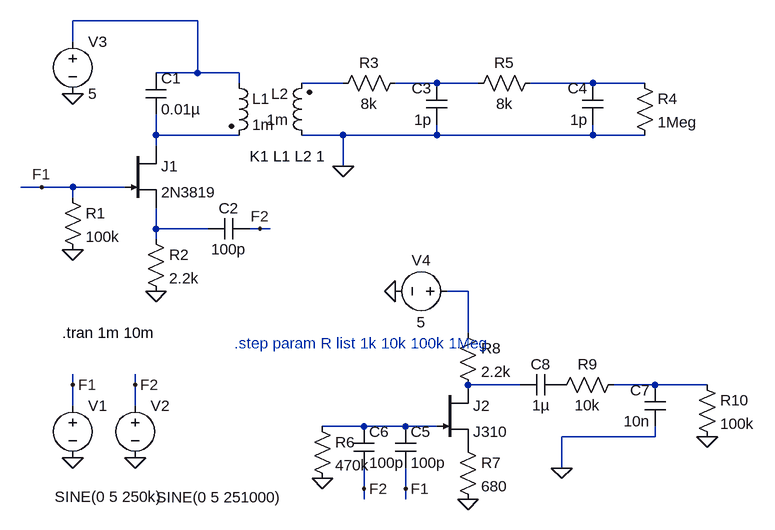
[diagram p0: schematic Draft2.asc]
Draft2.asc, the LTspice schematic file:
Version 4
SHEET 1 1184 680
WIRE 320 -144 128 -144
WIRE 128 -112 128 -144
WIRE 320 -64 320 -144
WIRE 320 -64 256 -64
WIRE 384 -64 320 -64
WIRE 384 -48 384 -64
WIRE 544 -48 480 -48
WIRE 688 -48 624 -48
WIRE 752 -48 688 -48
WIRE 928 -48 832 -48
WIRE 1008 -48 928 -48
WIRE 256 32 256 0
WIRE 384 32 256 32
WIRE 544 32 480 32
WIRE 688 32 688 16
WIRE 688 32 544 32
WIRE 928 32 928 16
WIRE 928 32 688 32
WIRE 1008 32 928 32
WIRE 256 48 256 32
WIRE 544 80 544 32
WIRE 80 112 48 112
WIRE 128 112 80 112
WIRE 208 112 128 112
WIRE 128 128 128 112
WIRE 256 176 256 144
WIRE 336 176 256 176
WIRE 416 176 400 176
WIRE 432 176 416 176
WIRE 256 192 256 176
WIRE 736 272 704 272
WIRE 736 336 736 272
WIRE 128 416 128 400
WIRE 224 416 224 400
WIRE 816 416 736 416
WIRE 1024 416 960 416
WIRE 1104 416 1024 416
WIRE 128 448 128 416
WIRE 224 448 224 416
WIRE 576 480 512 480
WIRE 640 480 576 480
WIRE 688 480 640 480
WIRE 1024 496 1024 480
WIRE 1024 496 880 496
WIRE 880 544 880 496
WIRE 576 576 576 544
WIRE 640 576 640 544
WIRE 576 592 576 576
WIRE 640 592 640 576
FLAG 128 528 0
FLAG 224 528 0
FLAG 128 416 F1
FLAG 224 416 F2
FLAG 128 -32 0
FLAG 128 208 0
FLAG 256 272 0
FLAG 80 112 F1
FLAG 416 176 F2
FLAG 544 80 0
FLAG 512 560 0
FLAG 736 592 0
FLAG 624 272 0
FLAG 576 576 F2
FLAG 640 576 F1
FLAG 880 544 0
FLAG 1104 496 0
SYMBOL Voltage 128 432 R0
WINDOW 3 -28 156 Left 2
SYMATTR Value SINE(0 5 250k)
SYMATTR InstName V1
SYMBOL Voltage 224 432 R0
WINDOW 3 32 157 Left 2
SYMATTR Value SINE(0 5 251000)
SYMATTR InstName V2
SYMBOL njf 208 48 R0
SYMATTR InstName J1
SYMATTR Value 2N3819
SYMBOL Res 112 112 R0
SYMATTR InstName R1
SYMATTR Value 100k
SYMBOL Res 240 176 R0
SYMATTR InstName R2
SYMATTR Value 2.2k
SYMBOL Cap 240 -64 R0
SYMATTR InstName C1
SYMATTR Value 0.01µ
SYMBOL Cap 336 192 R270
WINDOW 0 32 32 VTop 2
WINDOW 3 0 32 VBottom 2
SYMATTR InstName C2
SYMATTR Value 100p
SYMBOL ind2 368 -64 R0
SYMATTR InstName L1
SYMATTR Value 1m
SYMATTR Type ind
SYMBOL ind2 496 48 R180
WINDOW 0 36 80 Left 2
WINDOW 3 36 40 Left 2
SYMATTR InstName L2
SYMATTR Value 1m
SYMATTR Type ind
SYMBOL Voltage 128 -128 R0
SYMATTR InstName V3
SYMATTR Value 5
SYMBOL Res 640 -64 R90
WINDOW 0 0 56 VBottom 2
WINDOW 3 32 56 VTop 2
SYMATTR InstName R3
SYMATTR Value 8k
SYMBOL Cap 704 16 R180
WINDOW 0 24 56 Left 2
WINDOW 3 24 8 Left 2
SYMATTR InstName C3
SYMATTR Value 1p
SYMBOL Res 992 -64 R0
SYMATTR InstName R4
SYMATTR Value 1Meg
SYMBOL Cap 944 16 R180
WINDOW 0 24 56 Left 2
WINDOW 3 24 8 Left 2
SYMATTR InstName C4
SYMATTR Value 1p
SYMBOL Res 848 -64 R90
WINDOW 0 0 56 VBottom 2
WINDOW 3 32 56 VTop 2
SYMATTR InstName R5
SYMATTR Value 8k
SYMBOL njf 688 416 R0
SYMATTR InstName J2
SYMATTR Value J310
SYMBOL Cap 624 480 R0
SYMATTR InstName C5
SYMATTR Value 100p
SYMBOL Cap 560 480 R0
SYMATTR InstName C6
SYMATTR Value 100p
SYMBOL Res 496 464 R0
SYMATTR InstName R6
SYMATTR Value 470k
SYMBOL Res 720 496 R0
SYMATTR InstName R7
SYMATTR Value 680
SYMBOL Res 720 320 R0
SYMATTR InstName R8
SYMATTR Value 2.2k
SYMBOL Voltage 720 272 R90
WINDOW 0 -32 56 VBottom 2
WINDOW 3 32 56 VTop 2
SYMATTR InstName V4
SYMATTR Value 5
SYMBOL Res 976 400 R90
WINDOW 0 0 56 VBottom 2
WINDOW 3 32 56 VTop 2
SYMATTR InstName R9
SYMATTR Value 10k
SYMBOL Cap 1040 480 R180
WINDOW 0 24 56 Left 2
WINDOW 3 24 8 Left 2
SYMATTR InstName C7
SYMATTR Value 10n
SYMBOL Res 1088 400 R0
SYMATTR InstName R10
SYMATTR Value 100k
SYMBOL Cap 880 400 R90
WINDOW 0 0 32 VBottom 2
WINDOW 3 32 32 VTop 2
SYMATTR InstName C8
SYMATTR Value 1µ
TEXT 400 64 Left 2 !K1 L1 L2 1
TEXT 112 336 Left 2 !.tran 1m 10m
TEXT 376 352 Left 2 ;.step param R list 1k 10k 100k 1Meg

The netlist it stands for:
* Draft2.asc
V1 F1 0 SINE(0 5 250k)
V2 F2 0 SINE(0 5 251000)
J1 N005 F1 N006 2N3819
R1 F1 0 100k
R2 N006 0 2.2k
C1 N001 N005 0.01µ
C2 N006 F2 100p
L1 N001 N005 1m
L2 0 N002 1m
V3 N001 0 5
R3 N003 N002 8k
C3 0 N003 1p
R4 N004 0 1Meg
C4 0 N004 1p
R5 N004 N003 8k
J2 N008 N010 P001 J310
C5 N010 F1 100p
C6 N010 F2 100p
R6 N010 0 470k
R7 P001 0 680
R8 N007 N008 2.2k
V4 N007 0 5
R9 N009 P002 10k
C7 0 N009 10n
R10 N009 0 100k
C8 P002 N008 1µ
.model NJF NJF
.model PJF PJF
.lib standard.jft
K1 L1 L2 1
.tran 1m 10m
* .step param R list 1k 10k 100k 1Meg
.backanno
.end